# Altium schematic sheet Parts.SchDoc
size A; SheetNumber: 2; SheetTotal: 2
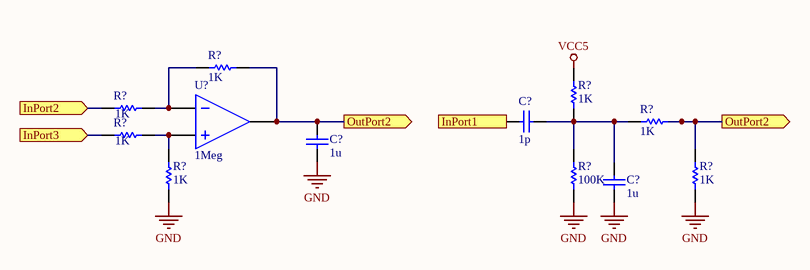
[diagram p0: Parts.SchDoc]

## Parts
(Parts that share a designator on the sheet are numbered #1, #2 ... from top to bottom, then left to right.)
C?#1  value 1p  (hidden comment: Capacitor)
C?#2  value 1u  (hidden comment: Capacitor)
C?#3  value 1u  (hidden comment: Capacitor)
R?#1  value 1K  (hidden comment: Resistor)
R?#2  value 1K  (hidden comment: Resistor)
R?#3  value 1K  (hidden comment: Resistor)
R?#4  value 1K  (hidden comment: Resistor)
R?#5  value 1K  (hidden comment: Resistor)
R?#6  value 1K  (hidden comment: Resistor)
R?#7  value 1K  (hidden comment: Resistor)
R?#8  value 100K  (hidden comment: Resistor)
U?  GAIN: 1Meg  (hidden comment: Ideal Operational Amplifier)

## Ports
InPort1 (in), InPort2 (in), InPort3 (in), OutPort2 (out)

## Nets
GND: C?#2.1 C?#3.1 R?#6.2 R?#7.1 R?#8.1
VCC5: R?#3.2
InPort1: C?#1.1 ; port InPort1
InPort2: R?#2.2 ; port InPort2
InPort3: R?#5.2 ; port InPort3
OutPort2: C?#2.2 R?#1.1 R?#4.1 R?#6.1 U?.3(OUT) ; port OutPort2
NetC?#1_2: C?#1.2 C?#3.2 R?#3.1 R?#4.2 R?#8.2
NetR?#1_2: R?#1.2 R?#2.1 U?.1(IN-)
NetR?#5_1: R?#5.1 R?#7.2 U?.2(IN+)

## Library data of the parts
C?#1-C?#3 = Capacitor: SimulationGenericComponent: True
R?#1-R?#8 = Resistor: TC1: 0; SimulationGenericComponent: True; TC2: 0
U? = OpAmp: SimulationGenericComponent: True